# Altium project Guitar Amp.PrjPCB
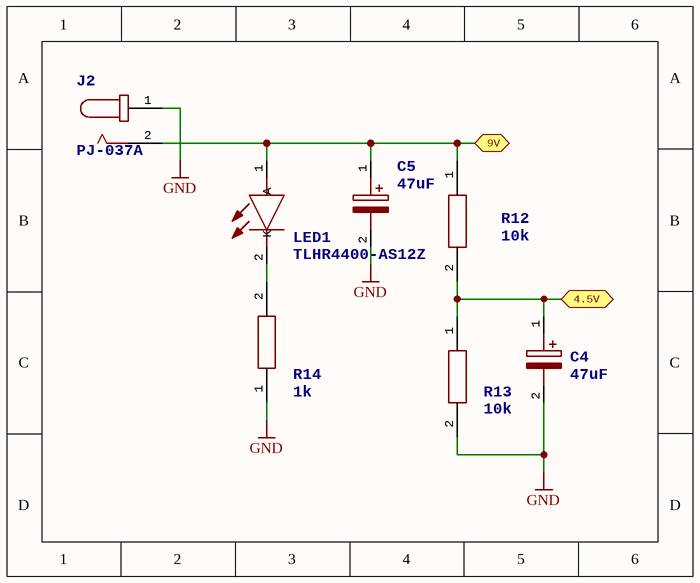
[diagram p0: Guitar Amp_0.SchDoc]
2 sheets, 28 parts. Net scope: flat (ports and power ports of the same name join across sheets).
Sheets:
  Guitar Amp_0.SchDoc
  Guitar Amp_1.SchDoc

## Sheet Guitar Amp_0.SchDoc
size 100 x 83 mm

### Parts
C4  47uF  [CAPPRD200W55D500H1200]
C5  47uF  [CAPPRD200W55D500H1200]
J2  PJ-037A  [CUI_PJ-037A]
LED1  TLHR4400-AS12Z  [TLHR4400AS12Z]
R12  10k  [RESAD1630W60L710D230]
R13  10k  [RESAD1630W60L710D230]
R14  1k  [RESAD1630W60L710D230]

### Ports
4.5V, 9V

### Nets
GND: C4.2(-) C5.2(-) J2.1 R13.2 R14.1
NetC4_1: C4.1(+) R12.2 R13.1 ; port 4.5V
NetC5_1: C5.1(+) J2.2 LED1.1(A) R12.1 ; port 9V
NetLED1_2: LED1.2(K) R14.2

### Library data of the parts
C4 C5 = ECA-1CM470: Panasonic Aluminium Electrolytic Capacitor 47uF 16V dc 5mm M Series Aluminium, Through Hole Electrolytic, +/-20%   Source:  Datasheet
J2 = PJ-037A: 2.0 mm Center Pin, 2.5 A, Right Angle, Through Hole, Dc Power Jack Connector Buy Part
LED1 = TLHR4400-AS12Z: Standard LEDs - Through Hole Red 13mcd; 3mm 612-625nm; 2V Typ   Source:  Datasheet
R12-R14 = MF1_4LCT52R103J: Metal Film Resistors - Through Hole 1/4 WATT 10K OHM 5%   Source:  Datasheet

## Sheet Guitar Amp_1.SchDoc
size 243 x 149 mm
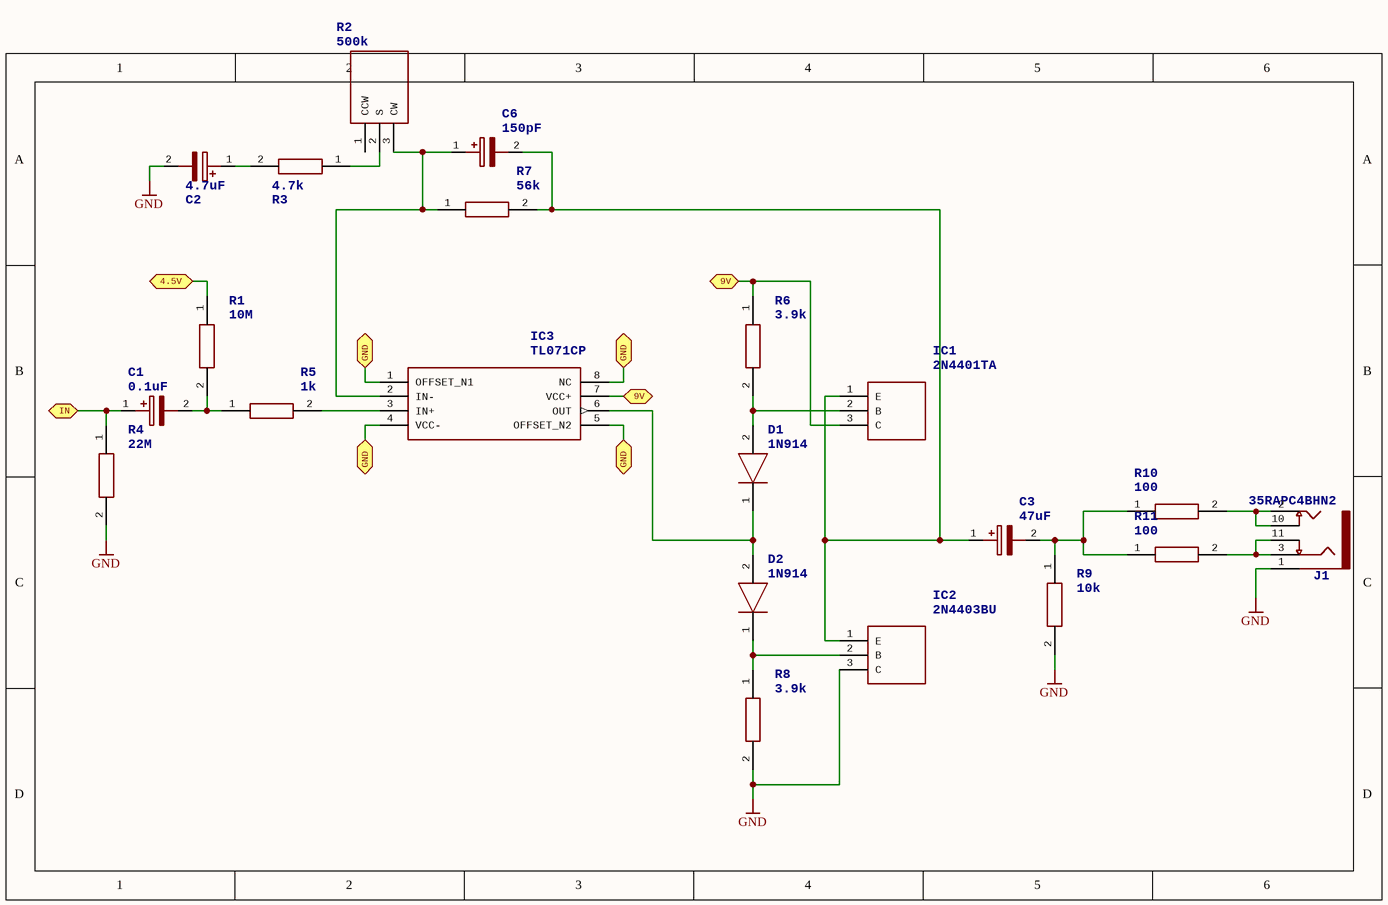
[diagram p1: Guitar Amp_1.SchDoc]

### Parts
C1  0.1uF  [CAPPRD200W55D500H1200]
C2  4.7uF  [CAPPRD200W55D500H1200]
C3  47uF  [CAPPRD200W55D500H1200]
C6  150pF  [CAPPRD200W55D500H1200]
D1  1N914  [DIO_1N914]
D2  1N914  [DIO_1N914]
IC1  2N4401TA  [KA431AZTA]
IC2  2N4403BU  [KA431AZTA]
IC3  TL071CP  [DIP794W53P254L959H508Q8N]
J1  35RAPC4BHN2  [SWITCHCRAFT_35RAPC4BHN2]
R1  10M  [RESAD1630W60L710D230]
R2  500k  [P160KN0QD15B1MEG]
R3  4.7k  [RESAD1630W60L710D230]
R4  22M  [RESAD1630W60L710D230]
R5  1k  [RESAD1630W60L710D230]
R6  3.9k  [RESAD1630W60L710D230]
R7  56k  [RESAD1630W60L710D230]
R8  3.9k  [RESAD1630W60L710D230]
R9  10k  [RESAD1630W60L710D230]
R10  100  [RESAD1630W60L710D230]
R11  100  [RESAD1630W60L710D230]

### Ports
4.5V, 9V, GND, IN

### Nets
GND: C2.2(-) IC2.3(C) J1.1 R4.2 R8.2 R9.2
NetC1_1: C1.1(+) R4.1 ; port IN
NetC1_2: C1.2(-) R1.2 R5.1
NetC2_1: C2.1(+) R3.2
NetC3_1: C3.1(+) C6.2(-) IC1.1(E) IC2.1(E) R7.2
NetC3_2: C3.2(-) R9.1 R10.1 R11.1
NetC4_1: R1.1 ; port 4.5V
NetC5_1: IC1.3(C) IC3.7(VCC+) R6.1 ; port 9V
NetC6_1: C6.1(+) IC3.2(IN-) R2.3(CW) R7.1
NetD1_1: D1.1(K) D2.2(A) IC3.6(OUT)
NetD1_2: D1.2(A) IC1.2(B) R6.2
NetD2_1: D2.1(K) IC2.2(B) R8.1
NetIC3_1: IC3.1(OFFSET_N1) IC3.4(VCC-) IC3.5(OFFSET_N2) IC3.8(NC) ; port GND
NetIC3_3: IC3.3(IN+) R5.2
NetJ1_2: J1.2 J1.10 R10.2
NetJ1_3: J1.3 J1.11 R11.2
NetR2_2: R2.2(S) R3.1

Not connected (* = marked no-connect by the designer): R2 1(CCW)

### Library data of the parts
C1-C3 C6 = ECA-1CM470: as C4 on sheet Guitar Amp_0
D1 D2 = 1N914: Small Signal Diode   Source:  Datasheet
IC1 = 2N4401TA: NPN General Purpose Amplifier   Source:  Datasheet
IC2 = 2N4403BU: PNP General Purpose Amplifier   Source:  Datasheet
IC3 = TL071CP: Low-Noise JFET-Input General-Purpose Operational Amplifier   Source:  Datasheet
J1 = 35RAPC4BHN2: Conn 3.5MM Stereo Jack F 5 POS Solder RA Thru-Hole 5 Terminal 1 Port
R1 R3-R11 = MF1_4LCT52R103J: as R12 on sheet Guitar Amp_0
R2 = P160KN-0QC15A500K: Potentiometers 16mm Rotary Panel Potentiometer   Source:  Datasheet

## Nets that join several sheets
GND: Guitar Amp_0 (5 pins), Guitar Amp_1 (6 pins)
NetC4_1: Guitar Amp_0 (C4.1 R12.2 R13.1), Guitar Amp_1 (R1.1)
NetC5_1: Guitar Amp_0 (C5.1 J2.2 LED1.1 R12.1), Guitar Amp_1 (IC1.3 IC3.7 R6.1)